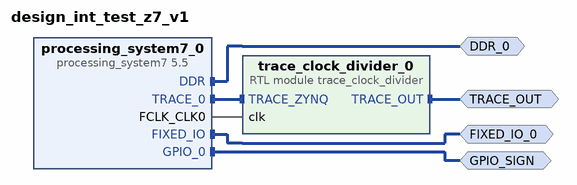
[diagram p0: block diagram of the top level]
# Vivado block design design_int_test_z7_v1, xc7z007sclg400-2, Vivado 2021.2
create_bd_design design_int_test_z7_v1

create_bd_intf_port -mode Master -vlnv xilinx.com:interface:zynq_trace_rtl:1.0 TRACE_OUT
create_bd_intf_port -mode Master -vlnv xilinx.com:interface:ddrx_rtl:1.0 DDR_0
create_bd_intf_port -mode Master -vlnv xilinx.com:display_processing_system7:fixedio_rtl:1.0 FIXED_IO_0
create_bd_intf_port -mode Master -vlnv xilinx.com:interface:gpio_rtl:1.0 GPIO_SIGN

create_bd_cell -type ip -vlnv xilinx.com:ip:processing_system7:5.5 processing_system7_0
set_property -dict [list \
  CONFIG.PCW_APU_PERIPHERAL_FREQMHZ 666.666666 \
  CONFIG.PCW_CPU_CPU_6X4X_MAX_RANGE 767 \
  CONFIG.PCW_ENET0_PERIPHERAL_ENABLE 0 \
  CONFIG.PCW_EN_RST0_PORT 0 \
  CONFIG.PCW_FPGA0_PERIPHERAL_FREQMHZ 200 \
  CONFIG.PCW_FPGA1_PERIPHERAL_FREQMHZ 2 \
  CONFIG.PCW_FPGA2_PERIPHERAL_FREQMHZ 200 \
  CONFIG.PCW_GPIO_EMIO_GPIO_ENABLE 1 \
  CONFIG.PCW_GPIO_EMIO_GPIO_IO 5 \
  CONFIG.PCW_GPIO_EMIO_GPIO_WIDTH 5 \
  CONFIG.PCW_GPIO_MIO_GPIO_ENABLE 0 \
  CONFIG.PCW_PERIPHERAL_BOARD_PRESET part0 \
  CONFIG.PCW_PRESET_BANK1_VOLTAGE {LVCMOS 1.8V} \
  CONFIG.PCW_QSPI_GRP_SINGLE_SS_ENABLE 1 \
  CONFIG.PCW_QSPI_GRP_SINGLE_SS_IO {MIO 1 .. 6} \
  CONFIG.PCW_QSPI_PERIPHERAL_ENABLE 1 \
  CONFIG.PCW_QSPI_QSPI_IO {MIO 1 .. 6} \
  CONFIG.PCW_SD0_PERIPHERAL_ENABLE 0 \
  CONFIG.PCW_SINGLE_QSPI_DATA_MODE x4 \
  CONFIG.PCW_TRACE_GRP_2BIT_ENABLE 1 \
  CONFIG.PCW_TRACE_GRP_4BIT_ENABLE 1 \
  CONFIG.PCW_TRACE_GRP_8BIT_ENABLE 1 \
  CONFIG.PCW_TRACE_INTERNAL_WIDTH 8 \
  CONFIG.PCW_TRACE_PERIPHERAL_ENABLE 1 \
  CONFIG.PCW_TRACE_TRACE_IO EMIO \
  CONFIG.PCW_UART1_PERIPHERAL_ENABLE 1 \
  CONFIG.PCW_UART1_UART1_IO {MIO 52 .. 53} \
  CONFIG.PCW_UART_PERIPHERAL_FREQMHZ 100 \
  CONFIG.PCW_UIPARAM_DDR_FREQ_MHZ 533.333 \
  CONFIG.PCW_UIPARAM_DDR_PARTNO {MT41J128M8 JP-125} \
  CONFIG.PCW_USB0_PERIPHERAL_ENABLE 0 \
  CONFIG.PCW_USE_M_AXI_GP0 0 \
] [get_bd_cells processing_system7_0]
# 351 more settings of processing_system7_0 are not shown: defaults, MIO pin electricals, DDR timing, and values the tool derives
create_bd_cell -type module -reference trace_clock_divider trace_clock_divider_0

# ---- connections ----

connect_bd_intf_net [get_bd_intf_ports DDR_0] [get_bd_intf_pins processing_system7_0/DDR]
connect_bd_intf_net [get_bd_intf_ports FIXED_IO_0] [get_bd_intf_pins processing_system7_0/FIXED_IO]
connect_bd_intf_net [get_bd_intf_ports GPIO_SIGN] [get_bd_intf_pins processing_system7_0/GPIO_0]
connect_bd_intf_net [get_bd_intf_pins processing_system7_0/TRACE_0] [get_bd_intf_pins trace_clock_divider_0/TRACE_ZYNQ]
connect_bd_intf_net [get_bd_intf_ports TRACE_OUT] [get_bd_intf_pins trace_clock_divider_0/TRACE_OUT]
connect_bd_net [get_bd_pins processing_system7_0/FCLK_CLK0] [get_bd_pins trace_clock_divider_0/clk]

validate_bd_design
save_bd_design
